# Altium schematic sheet 10-ZYNQ PWR & GND.SchDoc
size 513 x 386 mm
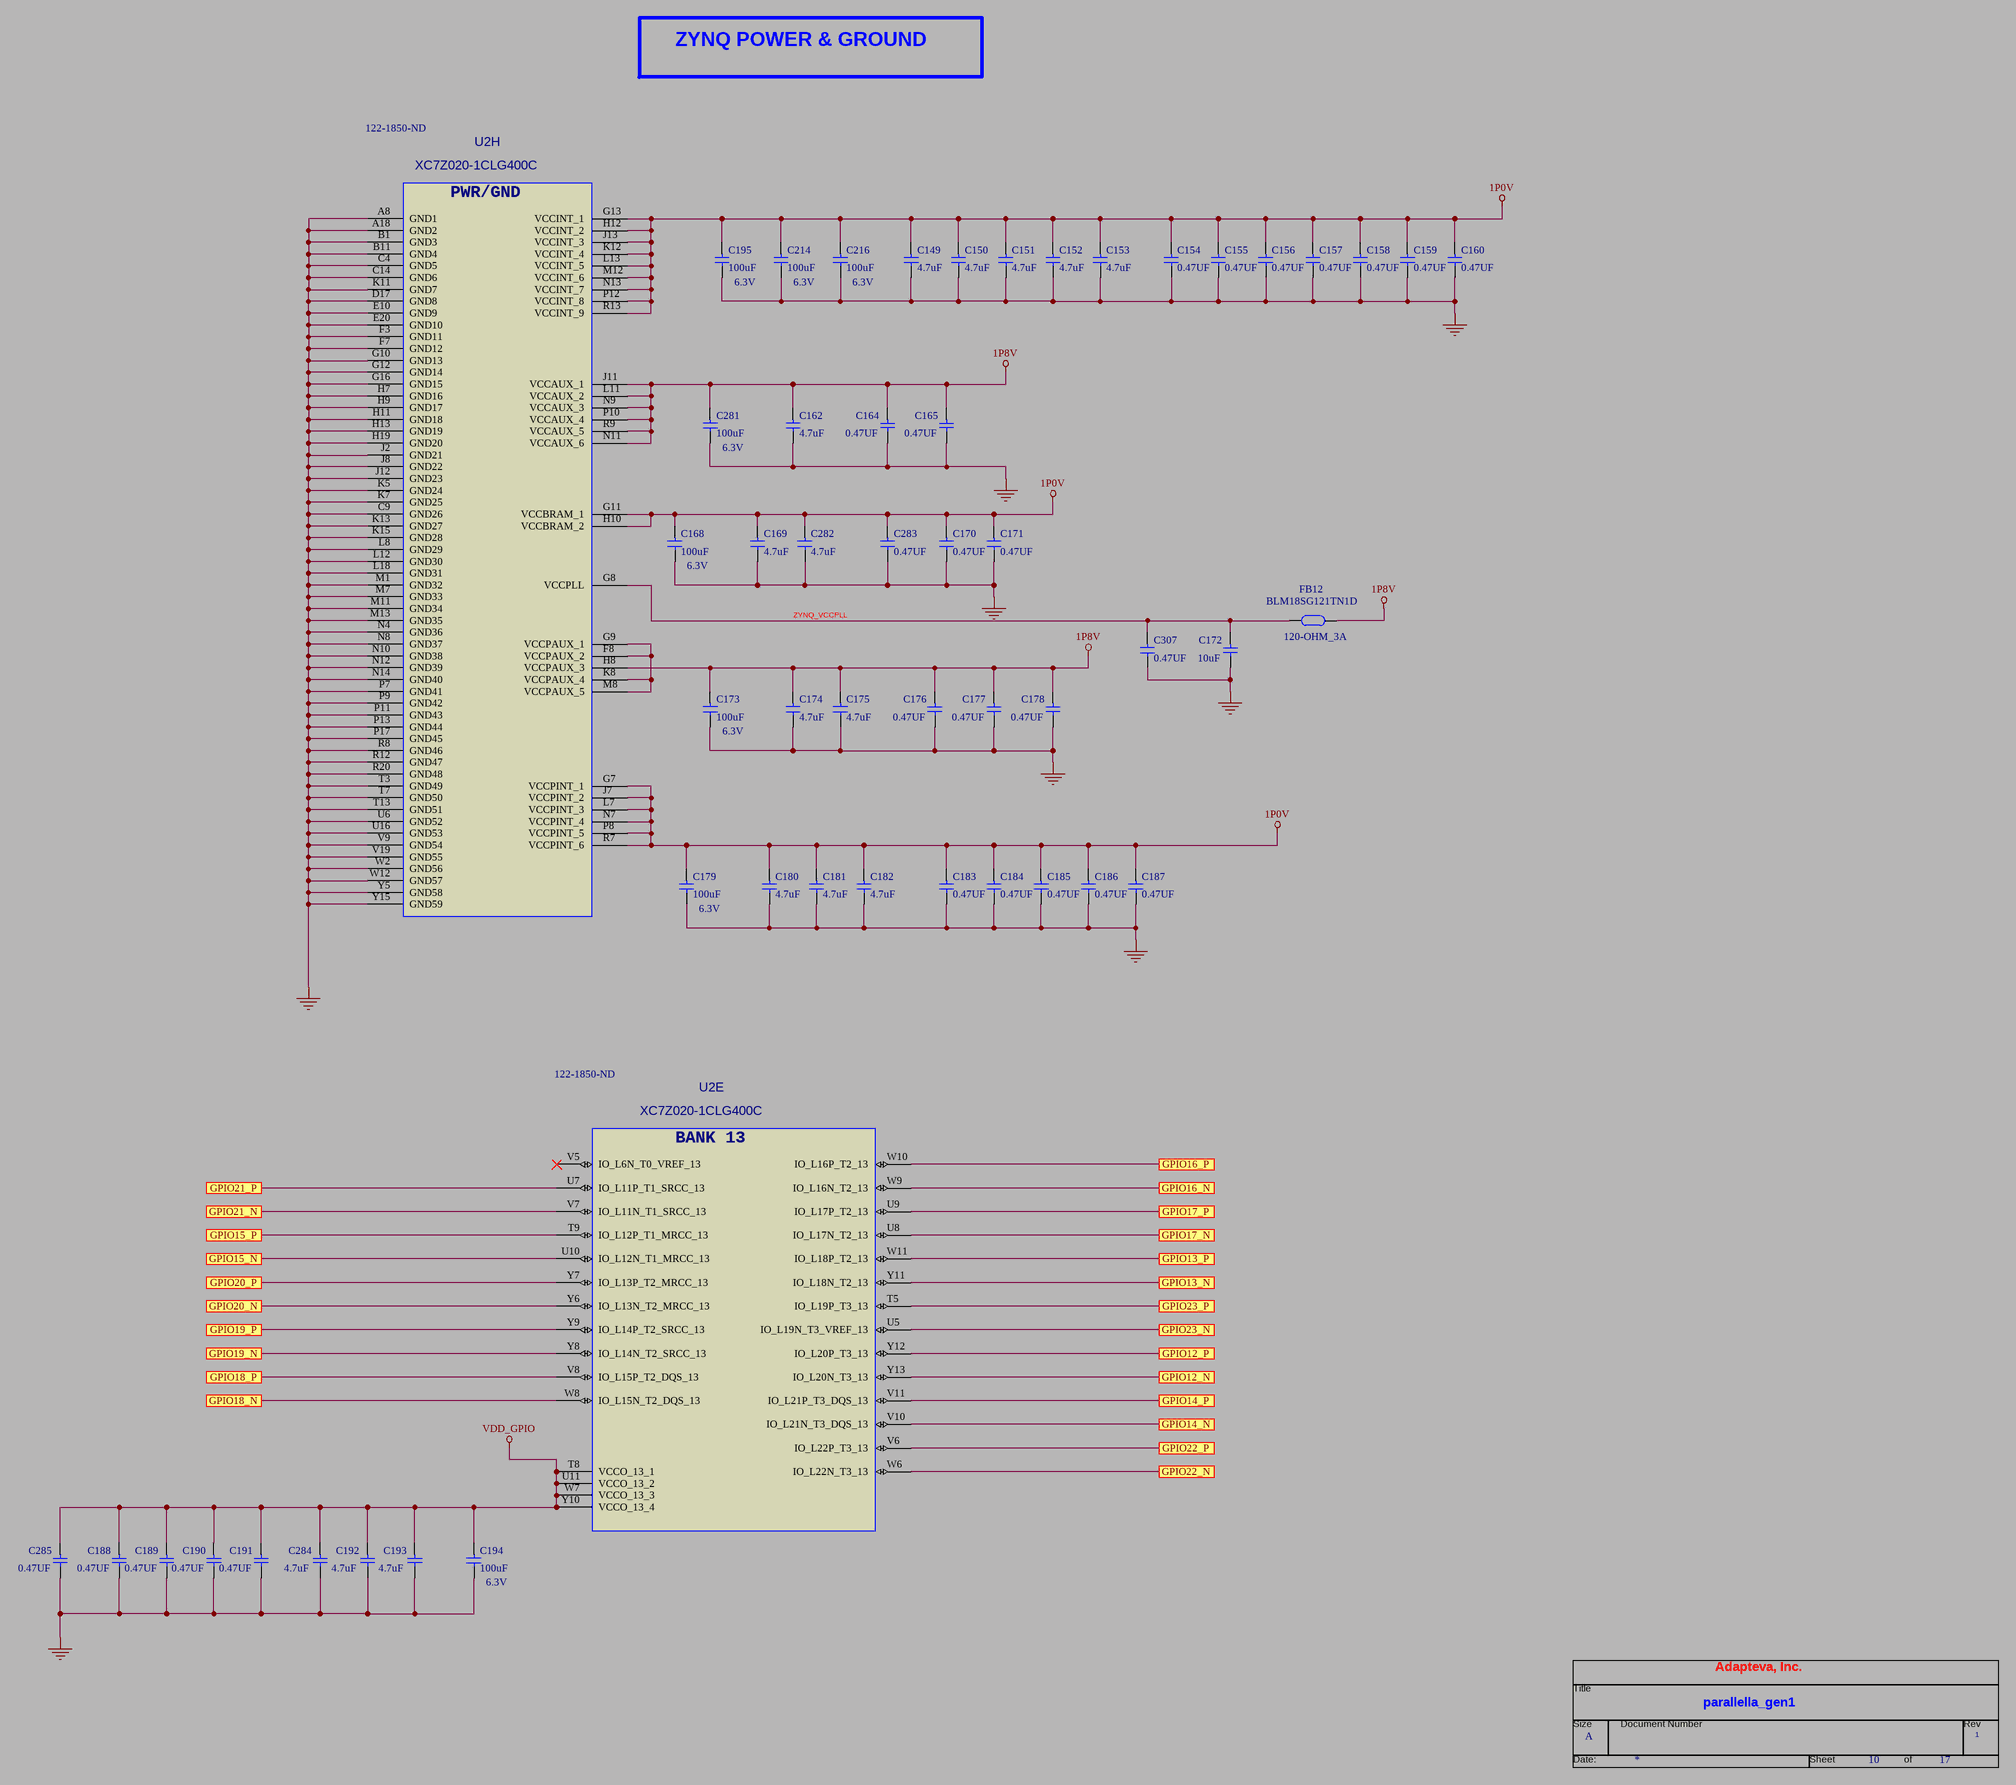
[diagram p0: 10-ZYNQ PWR & GND.SchDoc]

## Parts
*  RevCode: 1  Title: parallella_gen1  Page Size: A  Page Number: 10  Page Count: 17  OrgAddr1: Adapteva, Inc.  (hidden comment: TitleBlock0)  (graphical)
C149  4.7uF  [C0402]
C150  4.7uF  [C0402]
C151  4.7uF  [C0402]
C152  4.7uF  [C0402]
C153  4.7uF  [C0402]
C154  0.47UF  [C0402]
C155  0.47UF  [C0402]
C156  0.47UF  [C0402]
C157  0.47UF  [C0402]
C158  0.47UF  [C0402]
C159  0.47UF  [C0402]
C160  0.47UF  [C0402]
C162  4.7uF  [C0402]
C164  0.47UF  [C0402]
C165  0.47UF  [C0402]
C168  100uF  VOLTAGE: 6.3V  [C1210]
C169  4.7uF  [C0402]
C170  0.47UF  [C0402]
C171  0.47UF  [C0402]
C172  10uF  [C0603]
C173  100uF  VOLTAGE: 6.3V  [C1210]
C174  4.7uF  [C0402]
C175  4.7uF  [C0402]
C176  0.47UF  [C0402]
C177  0.47UF  [C0402]
C178  0.47UF  [C0402]
C179  100uF  VOLTAGE: 6.3V  [C1210]
C180  4.7uF  [C0402]
C181  4.7uF  [C0402]
C182  4.7uF  [C0402]
C183  0.47UF  [C0402]
C184  0.47UF  [C0402]
C185  0.47UF  [C0402]
C186  0.47UF  [C0402]
C187  0.47UF  [C0402]
C188  0.47UF  [C0402]
C189  0.47UF  [C0402]
C190  0.47UF  [C0402]
C191  0.47UF  [C0402]
C192  4.7uF  [C0402]
C193  4.7uF  [C0402]
C194  100uF  VOLTAGE: 6.3V  [C1210]
C195  100uF  VOLTAGE: 6.3V  [C1210]
C214  100uF  VOLTAGE: 6.3V  [C1210]
C216  100uF  VOLTAGE: 6.3V  [C1210]
C281  100uF  VOLTAGE: 6.3V  [C1210]
C282  4.7uF  [C0402]
C283  0.47UF  [C0402]
C284  4.7uF  [C0402]
C285  0.47UF  [C0402]
C307  0.47UF  [C0402]
FB12  120-OHM_3A  [BEAD_0603]
U2  Vendor PN: XC7Z020-1CLG400C  Supplier Part Number 1: 122-1850-ND  [CBGA400_17SQ_1P6H_P8MMP]  (hidden comment: 7Z020-CLG400)  (parts E,H of 8)

## Ports
GPIO12_N, GPIO12_P, GPIO13_N, GPIO13_P, GPIO14_N, GPIO14_P, GPIO15_N, GPIO15_P, GPIO16_N, GPIO16_P, GPIO17_N, GPIO17_P, GPIO18_N, GPIO18_P, GPIO19_N, GPIO19_P, GPIO20_N, GPIO20_P, GPIO21_N, GPIO21_P, GPIO22_N, GPIO22_P, GPIO23_N, GPIO23_P

## Nets
1P0V: C149.1 C150.1 C151.1 C152.1 C153.1 C154.1 C155.1 C156.1 C157.1 C158.1 C159.1 C160.1 C168.1 C169.1 C170.1 C171.1 C179.1 C180.1 C181.1 C182.1 C183.1 C184.1 C185.1 C186.1 C187.1 C195.1 C214.1 C216.1 C282.1 C283.1 U2.G7(VCCPINT_1) U2.G11(VCCBRAM_1) U2.G13(VCCINT_1) U2.H10(VCCBRAM_2) U2.H12(VCCINT_2) U2.J7(VCCPINT_2) U2.J13(VCCINT_3) U2.K12(VCCINT_4) U2.L7(VCCPINT_3) U2.L13(VCCINT_5) U2.M12(VCCINT_6) U2.N7(VCCPINT_4) U2.N13(VCCINT_7) U2.P8(VCCPINT_5) U2.P12(VCCINT_8) U2.R7(VCCPINT_6) U2.R13(VCCINT_9)
1P8V: C162.1 C164.1 C165.1 C173.1 C174.1 C175.1 C176.1 C177.1 C178.1 C281.1 FB12.1 U2.H8(VCCPAUX_3) U2.J11(VCCAUX_1) U2.L11(VCCAUX_2) U2.N9(VCCAUX_3) U2.N11(VCCAUX_6) U2.P10(VCCAUX_4) U2.R9(VCCAUX_5)
GND: C149.2 C150.2 C151.2 C152.2 C153.2 C154.2 C155.2 C156.2 C157.2 C158.2 C159.2 C160.2 C162.2 C164.2 C165.2 C168.2 C169.2 C170.2 C171.2 C172.2 C173.2 C174.2 C175.2 C176.2 C177.2 C178.2 C179.2 C180.2 C181.2 C182.2 C183.2 C184.2 C185.2 C186.2 C187.2 C188.2 C189.2 C190.2 C191.2 C192.2 C193.2 C194.2 C195.2 C214.2 C216.2 C281.2 C282.2 C283.2 C284.2 C285.2 C307.2 U2.A8(GND1) U2.A18(GND2) U2.B1(GND3) U2.B11(GND4) U2.C4(GND5) U2.C9(GND26) U2.C14(GND6) U2.D17(GND8) U2.E10(GND9) U2.E20(GND10) U2.F3(GND11) U2.F7(GND12) U2.G10(GND13) U2.G12(GND14) U2.G16(GND15) U2.H7(GND16) U2.H9(GND17) U2.H11(GND18) U2.H13(GND19) U2.H19(GND20) U2.J2(GND21) U2.J8(GND22) U2.J12(GND23) U2.K5(GND24) U2.K7(GND25) U2.K11(GND7) U2.K13(GND27) U2.K15(GND28) U2.L8(GND29) U2.L12(GND30) U2.L18(GND31) U2.M1(GND32) U2.M7(GND33) U2.M11(GND34) U2.M13(GND35) U2.N4(GND36) U2.N8(GND37) U2.N10(GND38) U2.N12(GND39) U2.N14(GND40) U2.P7(GND41) U2.P9(GND42) U2.P11(GND43) U2.P13(GND44) U2.P17(GND45) U2.R8(GND46) U2.R12(GND47) U2.R20(GND48) U2.T3(GND49) U2.T7(GND50) U2.T13(GND51) U2.U6(GND52) U2.U16(GND53) U2.V9(GND54) U2.V19(GND55) U2.W2(GND56) U2.W12(GND57) U2.Y5(GND58) U2.Y15(GND59)
VDD_GPIO: C188.1 C189.1 C190.1 C191.1 C192.1 C193.1 C194.1 C284.1 C285.1 U2.T8(VCCO_13_1) U2.U11(VCCO_13_2) U2.W7(VCCO_13_3) U2.Y10(VCCO_13_4)
GPIO12_N: U2.Y13(IO_L20N_T3_13) ; port GPIO12_N
GPIO12_P: U2.Y12(IO_L20P_T3_13) ; port GPIO12_P
GPIO13_N: U2.Y11(IO_L18N_T2_13) ; port GPIO13_N
GPIO13_P: U2.W11(IO_L18P_T2_13) ; port GPIO13_P
GPIO14_N: U2.V10(IO_L21N_T3_DQS_13) ; port GPIO14_N
GPIO14_P: U2.V11(IO_L21P_T3_DQS_13) ; port GPIO14_P
GPIO15_N: U2.U10(IO_L12N_T1_MRCC_13) ; port GPIO15_N
GPIO15_P: U2.T9(IO_L12P_T1_MRCC_13) ; port GPIO15_P
GPIO16_N: U2.W9(IO_L16N_T2_13) ; port GPIO16_N
GPIO16_P: U2.W10(IO_L16P_T2_13) ; port GPIO16_P
GPIO17_N: U2.U8(IO_L17N_T2_13) ; port GPIO17_N
GPIO17_P: U2.U9(IO_L17P_T2_13) ; port GPIO17_P
GPIO18_N: U2.W8(IO_L15N_T2_DQS_13) ; port GPIO18_N
GPIO18_P: U2.V8(IO_L15P_T2_DQS_13) ; port GPIO18_P
GPIO19_N: U2.Y8(IO_L14N_T2_SRCC_13) ; port GPIO19_N
GPIO19_P: U2.Y9(IO_L14P_T2_SRCC_13) ; port GPIO19_P
GPIO20_N: U2.Y6(IO_L13N_T2_MRCC_13) ; port GPIO20_N
GPIO20_P: U2.Y7(IO_L13P_T2_MRCC_13) ; port GPIO20_P
GPIO21_N: U2.V7(IO_L11N_T1_SRCC_13) ; port GPIO21_N
GPIO21_P: U2.U7(IO_L11P_T1_SRCC_13) ; port GPIO21_P
GPIO22_N: U2.W6(IO_L22N_T3_13) ; port GPIO22_N
GPIO22_P: U2.V6(IO_L22P_T3_13) ; port GPIO22_P
GPIO23_N: U2.U5(IO_L19N_T3_VREF_13) ; port GPIO23_N
GPIO23_P: U2.T5(IO_L19P_T3_13) ; port GPIO23_P
ZYNQ_VCCPLL: C172.1 C307.1 FB12.2 U2.G8(VCCPLL)
NetU2_F8: U2.F8(VCCPAUX_2) U2.G9(VCCPAUX_1) U2.K8(VCCPAUX_4) U2.M8(VCCPAUX_5)

Not connected (* = marked no-connect by the designer): U2 V5(IO_L6N_T0_VREF_13)*

## Notes on the sheet
- ZYNQ POWER & GROUND
- (in symbol TitleBlock0) Title; Size; Document Number; Rev; Date:; Sheet; of
- (in symbol ZYNQ_7Z020_CLG400, part E) BANK 13
- (in symbol ZYNQ_7Z020_CLG400, part H) PWR/GND

## Library data of the parts
C149-C153 C162 C169 C174 C175 C180-C182 C192 C193 C282 C284 = CAP0402_4P7UF_X5R: CAP, 0402, 4.7UF, X5R, 6.3V; MFG PART NO: C1005X5R0J475K; MFG: TDK; ALT_SYMBOLS: C0402_BGA; DEVICE: CAP0402_4P7UF_X5R; Vendor: TDK; Vendor PN: C1005X5R0J475K; PCB Footprint: C0402
C154-C160 C164 C165 C170 C171 C176-C178 C183-C191 C283 C285 C307 = CAP0402_0P47UF_X5R: CAP, 0402, 0.47UF, X5R, 16V; MFG PART NO: C1005X5R1C474K; MFG: TDK; ALT_SYMBOLS: C0402_BGA; DEVICE: CAP0402_0P47UF_X5R; Vendor: TDK; Vendor PN: C1005X5R1C474K; PCB Footprint: C0402
C168 C173 C179 C194 C195 C214 C216 C281 = CAP1210_100UF_X5R_LOESR: CAP, 1210, 100UF, X5R, 6.3V, LOW ESR; MFG PART NO: GRM32ER60J107ME20L; MFG: MURATA; DEVICE: CAP1210_100UF_X5R_LOESR; Vendor: MURATA; Vendor PN: GRM32ER60J107ME20L; PCB Footprint: C1210
C172 = CAP0603_10UF_X5R: CAP, 0603, 10UF, X5R, 10V; MFG PART NO: LMK107BJ106MALTD; MFG: TAIYO YUDEN; DEVICE: CAP0603_10UF_X5R; Vendor: TAIYO YUDEN; Vendor PN: LMK107BJ106MALTD; PCB Footprint: C0603
FB12 = BLM18SG121TN1D: FERRITE, BEAD, FILTER, 0603, 3A; Vendor: MURATA; PCB Footprint: FB0603; Vendor PN: BLM18SG121TN1D; DEVICE: BLM18SG121TN1D
U2 = ZYNQ_7Z020_CLG400: IC, EPP, XILINX, ZYNQ, 7Z020, CLG400; SPLIT_INST: TRUE; Vendor: XILINX; DEVICE: ZYNQ_7Z020_CLG400; PCB Footprint: CBGA400_17SQ_1P6H_P8MMP; Supplier 1: Digi-Key
* = TitleBlock0: Page Create Date: March  8, 1995; Page Modify Date: *